# Altium schematic sheet DCDC_Converter.SchDoc
size A4; SheetNumber: 10; SheetTotal: 14
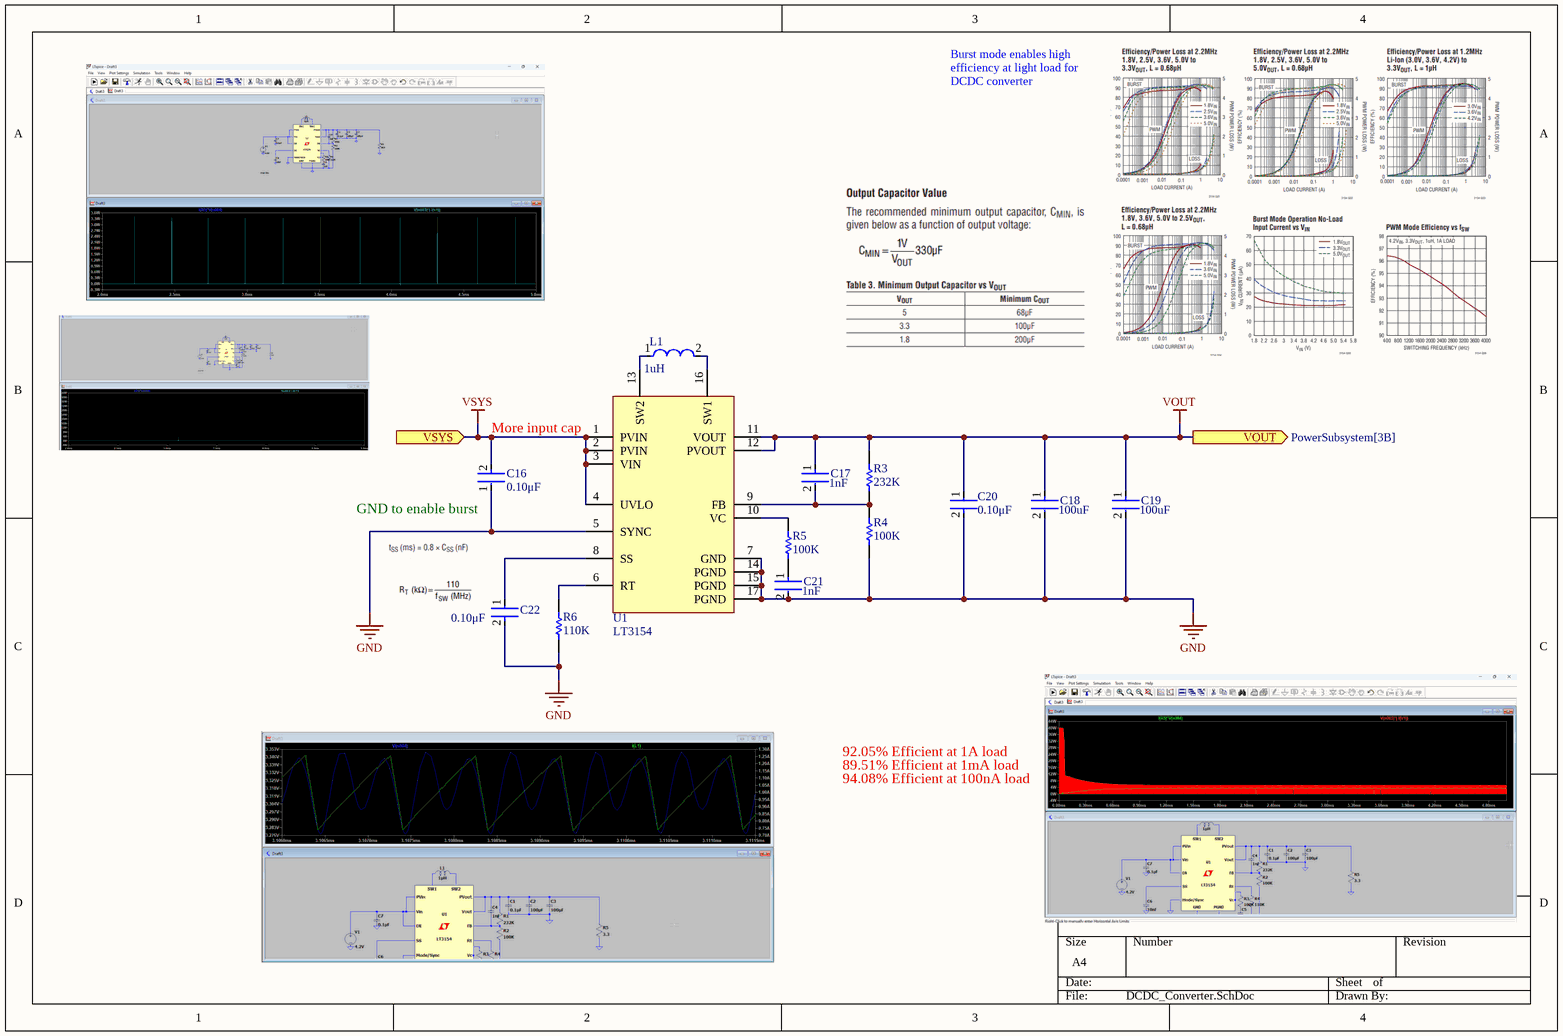
[diagram p0: DCDC_Converter.SchDoc]

## Parts
C16  Capacitance: 0.10μF  [FP-GRM15-MFG]  (hidden comment: GRM155R71C104KA88D)
C17  Capacitance: 1nF  [FP-GRM155-0_05-IPC_B]  (hidden comment: GRM1555C1H102JA01D)
C18  Capacitance: 100uF  [FP-GRM32E-0_3-0_2-IPC_B]  (hidden comment: GRM32ER61A107ME20L)
C19  Capacitance: 100uF  [FP-GRM32E-0_3-0_2-IPC_B]  (hidden comment: GRM32ER61A107ME20L)
C20  Capacitance: 0.10μF  [FP-GRM15-MFG]  (hidden comment: GRM155R71C104KA88D)
C21  Capacitance: 1nF  [FP-GRM155-0_05-IPC_B]  (hidden comment: GRM1555C1H102JA01D)
C22  Capacitance: 0.10μF  [FP-GRM15-MFG]  (hidden comment: GRM155R71C104KA88D)
L1  Inductance: 1uH  [FP-MLP2012M-IPC_C]  (hidden comment: MLP2012S1R0MT0S1)
R3  232K  [RESC1005X40X25NL10T10]
R4  100K  [RESC1005X40X25NL10T10]
R5  100K  [RESC1005X40X25NL10T10]
R6  110K  [RESC1005X40X25LL05T05]
U1  LT3154  [PQFN127P600-8N]

## Ports
VOUT (out, see PowerSubsystem[3B]), VSYS (in, see PowerSubsystem[3B], BMS[4C])

## Nets
GND: C16.1 C18.2 C19.2 C20.2 C21.2 C22.2 R4.1 R6.1 U1.5(SYNC) U1.7(GND) U1.14(PGND) U1.15(PGND) U1.17(PGND)
VOUT: C17.1 C18.1 C19.1 C20.1 R3.2 U1.11(VOUT) U1.12(PVOUT) ; port VOUT
VSYS: C16.2 U1.1(PVIN) U1.2(PVIN) U1.3(VIN) U1.4(UVLO) ; port VSYS
NetC17_2: C17.2 R3.1 R4.2 U1.9(FB)
NetC21_1: C21.1 R5.1
NetC22_1: C22.1 U1.8(SS)
NetL1_1: L1.1 U1.13(SW2)
NetL1_2: L1.2 U1.16(SW1)
NetR5_2: R5.2 U1.10(VC)
NetR6_2: R6.2 U1.6(RT)

## Notes on the sheet
- Burst mode enables high efficiency at light load for DCDC converter
- (near U1) More input cap
- (near C16) GND to enable burst
- 92.05% Efficient at 1A load
- 89.51% Efficient at 1mA load
- 94.08% Efficient at 100nA load

## Library data of the parts
C16 C20 C22 = CMP-2100-03641-2: CAP CER 0.1UF 16V X7R 0402; Manufacturer: Murata; Standoff Height: 0mm; Tolerance: 10%; Voltage Rating: 16Vdc; Material: Ceramic; Value: 0.10μF; RoHS: TRUE; Manufacturer Part Number: GRM155R71C104KA88D; Temperature Characteristic: X7R; Octopart: https://octopart.com/grm155r71c104ka88d-murata-196880; Digikey Description: CAP CER 0.1UF 16V X7R 0402; Device Class L3: Ceramic Capacitors; Height: 0.55mm; ComponentLink2Description: Datasheet; Temperature Range Low: -55°C; Ipc Land Pattern Name: CAPC10050X219; ComponentLink2URL: https://search.murata.co.jp/Ceramy/image/img/A01X/G101/ENG/GRM155R71H471KA01-01A.pdf; Device Class L1: Passive Components; Lead Free: yes; Category: Cap; Package: GRM15; Temperature: -55°C to +125°C; Device Class L2: Capacitors; Temperature Range High: +125°C; Mouser Description: 0402 0.1 uF 16V ±10 % Tolerance X7R SMT Multilayer Ceramic Capacitor
C17 C21 = CMP-2008-04254-2: Chip Multilayer Ceramic Capacitors for General Purpose, 0402, 1000pF, C0G, 30ppm/°C, 5%, 50V; Insulation Resistance: 10GR; Packaging: Tape and Reel; Lead Free: Lead Free; Tolerance: 5%; Temperature Coefficient: 30ppm/°C; Thickness: 0.022inch; Termination: SMD/SMT; Max Operating Temperature: 125°C; Height: 0.5mm; Package Quantity: 1; Radiation Hardening: No; Material: Ceramic; Case Code (Metric): 1005; Number of Pins: 2; Voltage Rating: 50V; Mount: Surface Mount; Voltage: 50V; Case/Package: 0402; Min Operating Temperature: -55°C; Dielectric Material: Ceramic; Width: 0.5mm; Depth: 0.5mm; Case Code (Imperial): 0402; REACH SVHC: No SVHC; Dielectric: C0G; Voltage Rating (DC): 50V; Length: 1mm
C18 C19 = CMP-06035-048205-1: Chip Multilayer Ceramic Capacitors for General Purpose, 1210, 100uF, X5R, 15%, 20%, 10V; Dissipation Factor: 0.035%; Packaging: Tape and Reel; Width: 2.5mm; Case/Package: 1210; Min Operating Temperature: -55°C; Depth: 2.5mm; Package Quantity: 1000; Case Code (Imperial): 1210; Voltage Rating: 10V; Dielectric Material: Ceramic; Length: 3.2mm; Lead Free: Lead Free; REACH SVHC: No SVHC; Mount: Surface Mount; Height: 2.5mm; Voltage Rating (DC): 10V; Dielectric: X5R; Thickness: 0.106inch; Weight: 0.00388oz; Material: Ceramic; Termination: SMD/SMT; Tolerance: 20%; Case Code (Metric): 3225; Voltage: 10V; Max Operating Temperature: 85°C
L1 = CMP-08253-000385-1: Shielded Multilayer Inductor 1uH ±20% 1000mA 208mΩ SMD 0805; Test Frequency: 2MHz; Current Rating: 1A; DC Resistance (DCR): 208mR; Core Material: Ferrite; RoHS Compliant: Yes; Min Operating Temperature: -40°C; Length: 0.079inch; Shielding: Shielded; Tolerance: 20%; Max Operating Temperature: 125°C; Case Code (Metric): 2012; Packaging: Cut Tape; Width: 0.049inch; Mount: Surface Mount; Case Code (Imperial): 0805; Height - Seated (Max): 0.039inch; Package Quantity: 4000; Case/Package: 0805
R3-R5 = CMP-2002-04173-1: Part Number: RK73H1ETTP1003F; Manufacturer: KOA Speer
R6 = CMP-2002-00441-1: Manufacturer: Panasonic; Part Number: ERJ-2GEJ114X
U1 = LT3154: 5.5V 6A Low-IQ Monolithic / Buck-Boost DC/DC Converter